# Altium schematic sheet MSP-RFID.SchDoc
size A3; PageSetup: Record=PageOptions|CenterHorizontal=True|CenterVertical=True|PrintScale=0.71|XCorrection=1.00|YCorrection=1.00|PrintKind=1|BorderSize=5000000|LeftOffset=0|BottomOffset=0|Orientation=2|PaperLength=1000|PaperWidth=1000|Scale=100|PaperSource=7|PrintQuality=-4|MediaType=1|DitherType=10|PaperKind=A3|PrintScaleMode=1
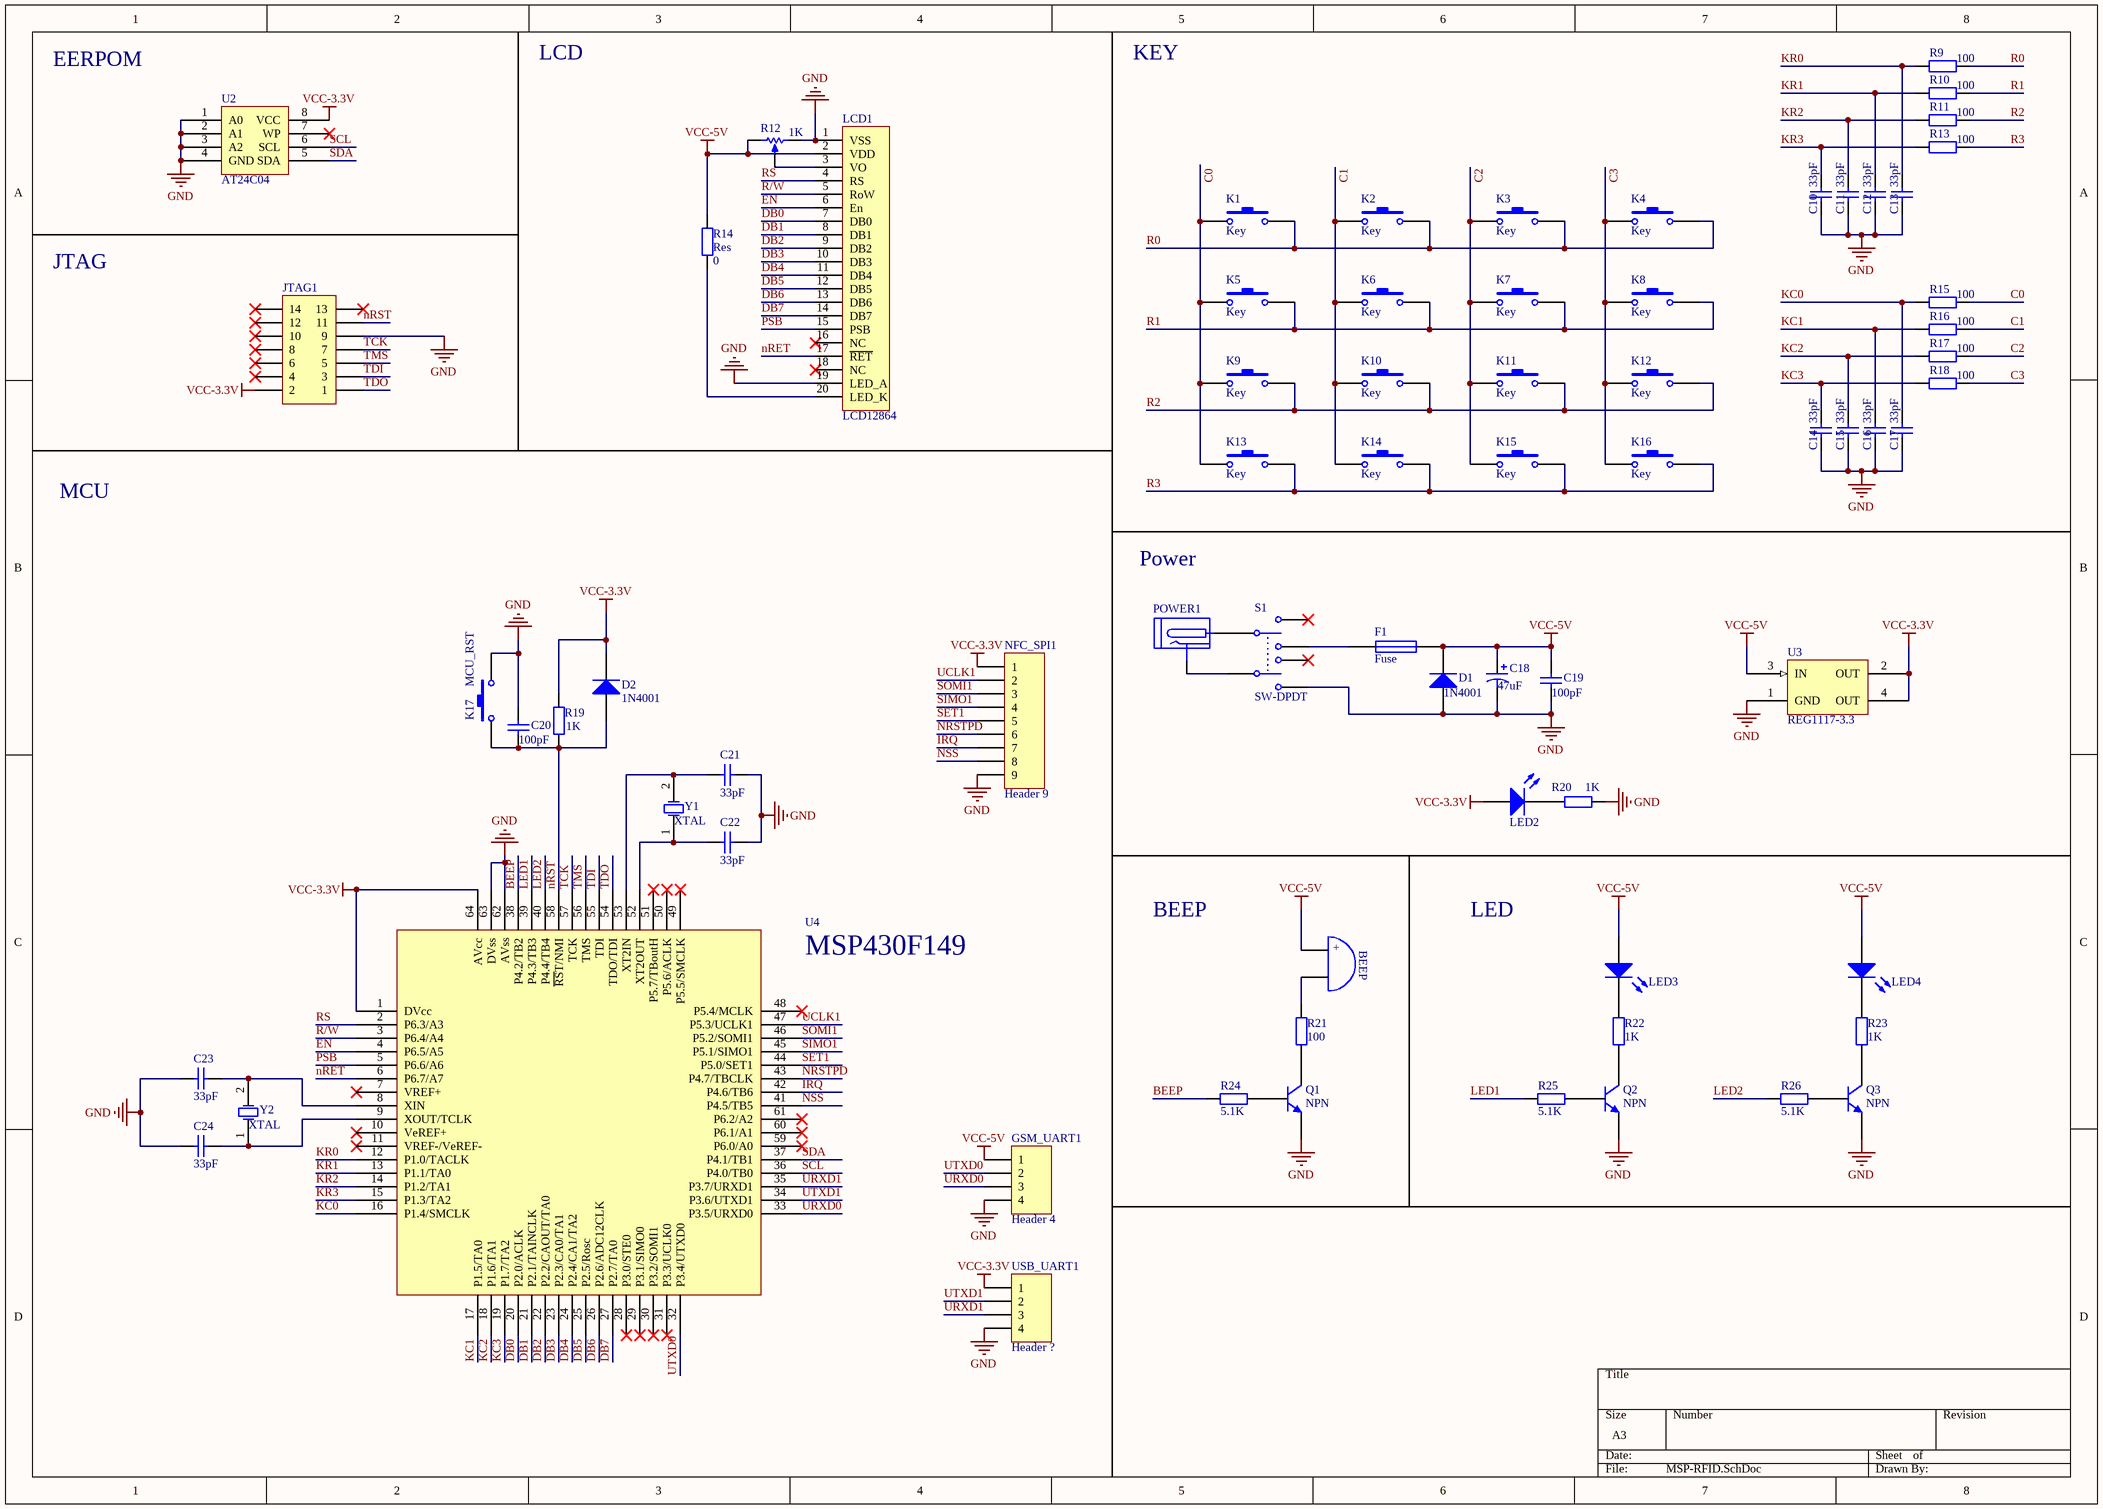
[diagram p0: MSP-RFID.SchDoc]

## Parts
BEEP1  BEEP  [BEEP]  (value not drawn)
C10  value 33pF  [1608[0603]]  (hidden comment: Cap)
C11  value 33pF  [1608[0603]]  (hidden comment: Cap)
C12  value 33pF  [1608[0603]]  (hidden comment: Cap)
C13  value 33pF  [1608[0603]]  (hidden comment: Cap)
C14  value 33pF  [1608[0603]]  (hidden comment: Cap)
C15  value 33pF  [1608[0603]]  (hidden comment: Cap)
C16  value 33pF  [1608[0603]]  (hidden comment: Cap)
C17  value 33pF  [1608[0603]]  (hidden comment: Cap)
C18  value 47uF  [1608[0603] - POL]  (hidden comment: CAP POL)
C19  value 100pF  [1608[0603]]  (hidden comment: Cap)
C20  value 100pF  [1608[0603]]  (hidden comment: Cap)
C21  value 33pF  [1608[0603]]  (hidden comment: Cap)
C22  value 33pF  [1608[0603]]  (hidden comment: Cap)
C23  value 33pF  [1608[0603]]  (hidden comment: Cap)
C24  value 33pF  [1608[0603]]  (hidden comment: Cap)
D1  1N4001  [1608[0603] - POL]
D2  1N4001  [1608[0603] - POL]
F1  Fuse  [1608[0603]]
GSM_UART1  Header 4  [HDR1X4]
JTAG1  Header 7X2H  [HDR2X7H]  (value not drawn)
K1  Key  [Key-4]
K2  Key  [Key-4]
K3  Key  [Key-4]
K4  Key  [Key-4]
K5  Key  [Key-4]
K6  Key  [Key-4]
K7  Key  [Key-4]
K8  Key  [Key-4]
K9  Key  [Key-4]
K10  Key  [Key-4]
K11  Key  [Key-4]
K12  Key  [Key-4]
K13  Key  [Key-4]
K14  Key  [Key-4]
K15  Key  [Key-4]
K16  Key  [Key-4]
K17  MCU_RST  [Key-4]
LCD1  LCD12864  [LCD-20PIN]
LED2  LED  [2012[0805] - POL]  (value not drawn)
LED3  LED  [1608[0603] - POL]  (value not drawn)
LED4  LED  [1608[0603] - POL]  (value not drawn)
NFC_SPI1  Header 9  [HDR1X9]
POWER1  POWER  [POWER]  (value not drawn)
Q1  NPN  [SOT23-3L]
Q2  NPN  [SOT23-3L]
Q3  NPN  [SOT23-3L]
R9  value 100  [1608[0603]]  (hidden comment: RES)
R10  value 100  [1608[0603]]  (hidden comment: RES)
R11  value 100  [1608[0603]]  (hidden comment: RES)
R12  value 1K  [VR5]  (hidden comment: RPot)
R13  value 100  [1608[0603]]  (hidden comment: RES)
R14  Res  value 0  [1608[0603]]
R15  value 100  [1608[0603]]  (hidden comment: RES)
R16  value 100  [1608[0603]]  (hidden comment: RES)
R17  value 100  [1608[0603]]  (hidden comment: RES)
R18  value 100  [1608[0603]]  (hidden comment: RES)
R19  value 1K  [1608[0603]]  (hidden comment: Res)
R20  value 1K  [1608[0603]]  (hidden comment: Res)
R21  value 100  [1608[0603]]  (hidden comment: Res)
R22  value 1K  [1608[0603]]  (hidden comment: Res)
R23  value 1K  [1608[0603]]  (hidden comment: Res)
R24  value 5.1K  [1608[0603]]  (hidden comment: Res)
R25  value 5.1K  [1608[0603]]  (hidden comment: Res)
R26  value 5.1K  [1608[0603]]  (hidden comment: Res)
S1  SW-DPDT  [DPDT-6]
U2  AT24C04  [SOIC127P600-8AN]
U3  REG1117-3.3  [SOT223]
U4  MSP430F149  [SQFP50P1200X1200-64N]
USB_UART1  Header ?  [HDR1X4]
Y1  XTAL  [XTAL]
Y2  XTAL  [XTAL]

## Nets
GND: C10.2 C11.2 C12.2 C13.2 C14.2 C15.2 C16.2 C17.2 C18.2 C19.1 C20.2 C21.1 C22.1 C23.2 C24.2 D1.1(A) GSM_UART1.4 JTAG1.9 K17.2 LCD1.1(VSS) LCD1.19(LED_A) NFC_SPI1.9 Q1.3(E) Q2.3(E) Q3.3(E) R12.2(BOT) R20.2 S1.6 U2.1(A0) U2.2(A1) U2.3(A2) U2.4(GND) U3.1(GND) U4.62(AVss) U4.63(DVss) USB_UART1.4
VCC-3.3V: D2.2(K) JTAG1.2 LED2.1(A) NFC_SPI1.1 R19.2 U2.8(VCC) U3.2(OUT) U3.4(OUT) U4.1(DVcc) U4.64(AVcc) USB_UART1.1
VCC-5V: BEEP1.1(B) C18.1 C19.2 D1.2(K) F1.2 GSM_UART1.1 LCD1.2(VDD) LED3.1(A) LED4.1(A) R12.1(TOP) R14.2 U3.3(IN)
BEEP: R24.1 U4.38(P4.2/TB2)
C0: K1.1 K5.1 K9.1 K13.1 R15.2
C1: K2.1 K6.1 K10.1 K14.1 R16.2
C2: K3.1 K7.1 K11.1 K15.1 R17.2
C3: K4.1 K8.1 K12.1 K16.1 R18.2
DB0: LCD1.7(DB0) U4.20(P2.0/ACLK)
DB1: LCD1.8(DB1) U4.21(P2.1/TAINCLK)
DB2: LCD1.9(DB2) U4.22(P2.2/CAOUT/TA0)
DB3: LCD1.10(DB3) U4.23(P2.3/CA0/TA1)
DB4: LCD1.11(DB4) U4.24(P2.4/CA1/TA2)
DB5: LCD1.12(DB5) U4.25(P2.5/Rosc)
DB6: LCD1.13(DB6) U4.26(P2.6/ADC12CLK)
DB7: LCD1.14(DB7) U4.27(P2.7/TA0)
EN: LCD1.6(En) U4.4(P6.5/A5)
IRQ: NFC_SPI1.7 U4.42(P4.6/TB6)
KC0: C17.1 R15.1 U4.16(P1.4/SMCLK)
KC1: C16.1 R16.1 U4.17(P1.5/TA0)
KC2: C15.1 R17.1 U4.18(P1.6/TA1)
KC3: C14.1 R18.1 U4.19(P1.7/TA2)
KR0: C13.1 R9.1 U4.12(P1.0/TACLK)
KR1: C12.1 R10.1 U4.13(P1.1/TA0)
KR2: C11.1 R11.1 U4.14(P1.2/TA1)
KR3: C10.1 R13.1 U4.15(P1.3/TA2)
LED1: R25.1 U4.39(P4.3/TB3)
LED2: R26.1 U4.40(P4.4/TB4)
nRET: LCD1.17(~{RET}) U4.6(P6.7/A7)
nRST: C20.1 D2.1(A) JTAG1.11 K17.1 R19.1 U4.58(~{RS}T/NMI)
NRSTPD: NFC_SPI1.6 U4.43(P4.7/TBCLK)
NSS: NFC_SPI1.8 U4.41(P4.5/TB5)
PSB: LCD1.15(PSB) U4.5(P6.6/A6)
R0: K1.2 K2.2 K3.2 K4.2 R9.2
R1: K5.2 K6.2 K7.2 K8.2 R10.2
R2: K9.2 K10.2 K11.2 K12.2 R11.2
R3: K13.2 K14.2 K15.2 K16.2 R13.2
R/W: LCD1.5(RoW) U4.3(P6.4/A4)
RS: LCD1.4(RS) U4.2(P6.3/A3)
SCL: U2.6(SCL) U4.36(P4.0/TB0)
SDA: U2.5(SDA) U4.37(P4.1/TB1)
SET1: NFC_SPI1.5 U4.44(P5.0/SET1)
SIMO1: NFC_SPI1.4 U4.45(P5.1/SIMO1)
SOMI1: NFC_SPI1.3 U4.46(P5.2/SOMI1)
TCK: JTAG1.7 U4.57(TCK)
TDI: JTAG1.3 U4.55(TDI)
TDO: JTAG1.1 U4.54(TDO/TDI)
TMS: JTAG1.5 U4.56(TMS)
UCLK1: NFC_SPI1.2 U4.47(P5.3/UCLK1)
URXD0: GSM_UART1.3 U4.33(P3.5/URXD0)
URXD1: U4.35(P3.7/URXD1) USB_UART1.3
UTXD0: GSM_UART1.2 U4.32(P3.4/UTXD0)
UTXD1: U4.34(P3.6/UTXD1) USB_UART1.2
NetBEEP1_2: BEEP1.2(A) R21.1
NetC21_2: C21.2 U4.53(XT2IN) Y1.2(OSC2)
NetC22_2: C22.2 U4.52(XT2OUT) Y1.1(OSC1)
NetC23_1: C23.1 U4.8(XIN) Y2.2(OSC2)
NetC24_1: C24.1 U4.9(XOUT/TCLK) Y2.1(OSC1)
NetF1_1: F1.1 S1.3
NetLCD1_3: LCD1.3(VO) R12.3(TAP)
NetLCD1_20: LCD1.20(LED_K) R14.1
NetLED2_2: LED2.2(K) R20.1
NetLED3_2: LED3.2(K) R22.1
NetLED4_2: LED4.2(K) R23.1
NetPOWER1_1: POWER1.1 S1.1
NetPOWER1_2: POWER1.2 S1.4
NetQ1_1: Q1.1(C) R21.2
NetQ1_2: Q1.2(B) R24.2
NetQ2_1: Q2.1(C) R22.2
NetQ2_2: Q2.2(B) R25.2
NetQ3_1: Q3.1(C) R23.2
NetQ3_2: Q3.2(B) R26.2

Not connected (* = marked no-connect by the designer): JTAG1 4* 6* 8* 10* 12* 13* 14*; LCD1 16(NC)* 18(NC)*; S1 2* 5*; U2 7(WP)*; U4 7(VREF+)* 10(VeREF+)* 11(VREF-/VeREF-)* 28(P3.0/STE0)* 29(P3.1/SIMO0)* 30(P3.2/SOMI1)* 31(P3.3/UCLK0)* 48(P5.4/MCLK)* 49(P5.5/SMCLK)* 50(P5.6/ACLK)* 51(P5.7/TBoutH)* 59(P6.0/A0)* 60(P6.1/A1)* 61(P6.2/A2)*

## Notes on the sheet
- EERPOM
- LCD
- KEY
- JTAG
- MCU
- Power
- BEEP
- LED
- (in symbol BEEP) +

## Library data of the parts
C10-C17 C19-C24 = Cap: Capacitor; Published: 8-Jun-2000; LatestRevisionDate: 17-Jul-2002; LatestRevisionNote: Re-released for DXP Platform.; Publisher: Altium Limited
C18 = CAP POL: Polarized Capacitor (Axial); Published: 8-Jun-2000; LatestRevisionDate: 17-Jul-2002; LatestRevisionNote: Re-released for DXP Platform.; Publisher: Altium Limited
D1 D2 = Diode 1N4001: 1 Amp General Purpose Rectifier; Revision 1: 11-Jul-2000: SIM Model Added.; Revision 2: 17-Jul-2002: Re-released for DXP Platform.; Package Information: Latest Revision: Aug-1999; Code - JEDEC: DO-204-AL; Published: 8-Jun-2000; Datasheet: Latest Revision: 1998; Package Reference: DO-41; Publisher: Altium Limited
F1 = FUSE1
GSM_UART1 USB_UART1 = Header 4: Header, 4-Pin; LatestRevisionDate: 17-Jul-2002; LatestRevisionNote: Re-released for DXP Platform.; Publisher: Altium Limited
JTAG1 = Header 7X2H: Header, 7-Pin, Dual row, Right Angle; LatestRevisionDate: 17-Jul-2002; LatestRevisionNote: Re-released for DXP Platform.; Publisher: Altium Limited
K1-K17 = SW-PB
NFC_SPI1 = Header 9: Header, 9-Pin; LatestRevisionDate: 17-Jul-2002; LatestRevisionNote: Re-released for DXP Platform.; Publisher: Altium Limited
Q1-Q3 = NPN: pin to pad: 1>3 2>1 3>2
R9-R11 R13-R26 = RES: Resistor; Published: 8-Jun-2000; LatestRevisionDate: 17-Jul-2002; LatestRevisionNote: Re-released for DXP Platform.; Publisher: Altium Limited
R12 = RPot: Potentiometer; Sim Note: Enter the Resistance value and the set point into parameter fields.; Set Position: 0.5; Published: 8-Jun-2000; LatestRevisionDate: 17-Jul-2002; LatestRevisionNote: Re-released for DXP Platform.; PackageReference: VR5; Publisher: Altium Limited
S1 = SW-DPDT: Double-Pole, Double-Throw Switch; Published: 24-Mar-1999; LatestRevisionDate: 17-Jul-2002; LatestRevisionNote: Re-released for DXP Platform.; PackageReference: DPDT-6; Publisher: Altium Limited
U4 = F14X
Y1 Y2 = XTAL: Crystal Oscillator; Published: 8-Jun-2000; Revision: July-2002: Re-released for DXP Platform.; Publisher: Altium Limited